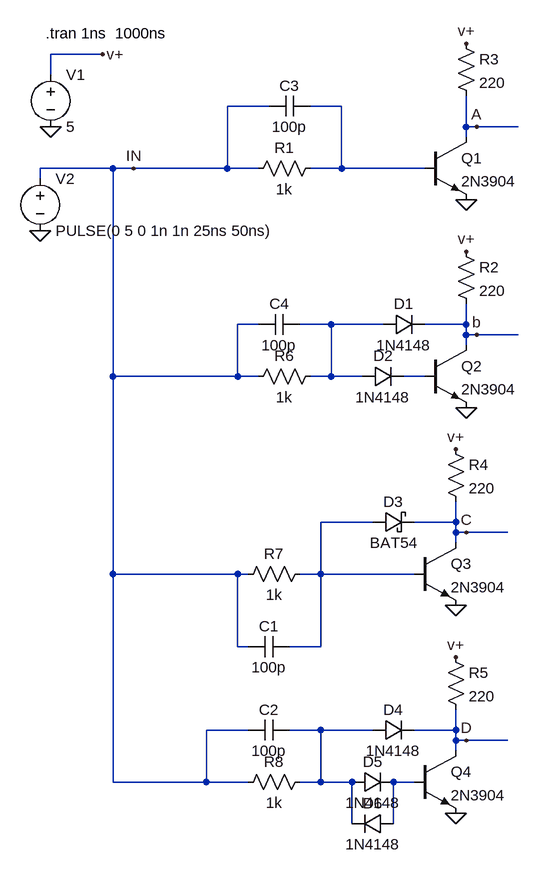
[diagram p0: schematic BakerClamps.asc]
BakerClamps.asc, the LTspice schematic file:
Version 4
SHEET 1 880 952
WIRE -176 -272 -256 -272
WIRE -256 -240 -256 -272
WIRE 80 -192 16 -192
WIRE 192 -192 144 -192
WIRE 384 -160 384 -208
WIRE 400 -160 384 -160
WIRE 464 -160 400 -160
WIRE 384 -144 384 -160
WIRE -160 -96 -272 -96
WIRE -128 -96 -160 -96
WIRE 16 -96 16 -192
WIRE 16 -96 -128 -96
WIRE 64 -96 16 -96
WIRE 192 -96 192 -192
WIRE 192 -96 144 -96
WIRE 320 -96 192 -96
WIRE -272 -80 -272 -96
WIRE 64 144 32 144
WIRE 176 144 128 144
WIRE 256 144 176 144
WIRE 384 144 384 112
WIRE 384 144 320 144
WIRE 384 160 384 144
WIRE 400 160 384 160
WIRE 464 160 400 160
WIRE 384 176 384 160
WIRE -160 224 -160 -96
WIRE 32 224 32 144
WIRE 32 224 -160 224
WIRE 64 224 32 224
WIRE 176 224 176 144
WIRE 176 224 144 224
WIRE 224 224 176 224
WIRE 320 224 288 224
WIRE 240 448 160 448
WIRE 368 448 368 416
WIRE 368 448 304 448
WIRE 368 464 368 448
WIRE 384 464 368 464
WIRE 448 464 384 464
WIRE 368 480 368 464
WIRE -160 528 -160 224
WIRE 32 528 -160 528
WIRE 48 528 32 528
WIRE 160 528 160 448
WIRE 160 528 128 528
WIRE 304 528 160 528
WIRE 32 640 32 528
WIRE 48 640 32 640
WIRE 160 640 160 528
WIRE 160 640 112 640
WIRE 48 768 -16 768
WIRE 160 768 112 768
WIRE 240 768 160 768
WIRE 368 768 368 736
WIRE 368 768 304 768
WIRE 368 784 368 768
WIRE 384 784 368 784
WIRE 448 784 384 784
WIRE 368 800 368 784
WIRE -160 848 -160 528
WIRE -16 848 -16 768
WIRE -16 848 -160 848
WIRE 48 848 -16 848
WIRE 160 848 160 768
WIRE 160 848 128 848
WIRE 208 848 160 848
WIRE 304 848 272 848
WIRE 208 912 208 848
WIRE 272 912 272 848
FLAG -256 -160 0
FLAG -176 -272 v+
FLAG -272 0 0
FLAG -128 -96 IN
FLAG 368 576 0
FLAG 368 336 v+
FLAG 384 464 C
FLAG 368 896 0
FLAG 368 656 v+
FLAG 384 784 D
FLAG 384 -48 0
FLAG 400 -160 A
FLAG 384 -288 v+
FLAG 384 272 0
FLAG 384 32 v+
FLAG 400 160 b
SYMBOL voltage -256 -256 R0
SYMATTR InstName V1
SYMATTR Value 5
SYMBOL voltage -272 -96 R0
SYMATTR InstName V2
SYMATTR Value PULSE(0 5 0 1n 1n 25ns 50ns)
SYMBOL npn 304 480 R0
SYMATTR InstName Q3
SYMATTR Value 2N3904
SYMBOL res 352 320 R0
SYMATTR InstName R4
SYMATTR Value 220
SYMBOL npn 304 800 R0
SYMATTR InstName Q4
SYMATTR Value 2N3904
SYMBOL res 352 640 R0
SYMATTR InstName R5
SYMATTR Value 220
SYMBOL res 144 512 R90
WINDOW 0 0 56 VBottom 2
WINDOW 3 32 56 VTop 2
SYMATTR InstName R7
SYMATTR Value 1k
SYMBOL res 144 832 R90
WINDOW 0 0 56 VBottom 2
WINDOW 3 32 56 VTop 2
SYMATTR InstName R8
SYMATTR Value 1k
SYMBOL schottky 240 464 R270
WINDOW 0 32 32 VTop 2
WINDOW 3 0 32 VBottom 2
SYMATTR InstName D3
SYMATTR Value BAT54
SYMATTR Description Diode
SYMATTR Type diode
SYMBOL diode 240 784 R270
WINDOW 0 32 32 VTop 2
WINDOW 3 0 32 VBottom 2
SYMATTR InstName D4
SYMATTR Value 1N4148
SYMBOL npn 320 -144 R0
SYMATTR InstName Q1
SYMATTR Value 2N3904
SYMBOL res 160 -112 R90
WINDOW 0 0 56 VBottom 2
WINDOW 3 32 56 VTop 2
SYMATTR InstName R1
SYMATTR Value 1k
SYMBOL res 368 -304 R0
SYMATTR InstName R3
SYMATTR Value 220
SYMBOL diode 208 864 R270
WINDOW 0 32 32 VTop 2
WINDOW 3 0 32 VBottom 2
SYMATTR InstName D5
SYMATTR Value 1N4148
SYMBOL diode 272 896 R90
WINDOW 0 0 32 VBottom 2
WINDOW 3 32 32 VTop 2
SYMATTR InstName D6
SYMATTR Value 1N4148
SYMBOL cap 112 624 R90
WINDOW 0 0 32 VBottom 2
WINDOW 3 32 32 VTop 2
SYMATTR InstName C1
SYMATTR Value 100p
SYMBOL cap 112 752 R90
WINDOW 0 0 32 VBottom 2
WINDOW 3 32 32 VTop 2
SYMATTR InstName C2
SYMATTR Value 100p
SYMBOL cap 144 -208 R90
WINDOW 0 0 32 VBottom 2
WINDOW 3 32 32 VTop 2
SYMATTR InstName C3
SYMATTR Value 100p
SYMBOL npn 320 176 R0
SYMATTR InstName Q2
SYMATTR Value 2N3904
SYMBOL res 368 16 R0
SYMATTR InstName R2
SYMATTR Value 220
SYMBOL res 160 208 R90
WINDOW 0 0 56 VBottom 2
WINDOW 3 32 56 VTop 2
SYMATTR InstName R6
SYMATTR Value 1k
SYMBOL diode 256 160 R270
WINDOW 0 32 32 VTop 2
WINDOW 3 0 32 VBottom 2
SYMATTR InstName D1
SYMATTR Value 1N4148
SYMBOL diode 224 240 R270
WINDOW 0 32 32 VTop 2
WINDOW 3 0 32 VBottom 2
SYMATTR InstName D2
SYMATTR Value 1N4148
SYMBOL cap 128 128 R90
WINDOW 0 0 32 VBottom 2
WINDOW 3 32 32 VTop 2
SYMATTR InstName C4
SYMATTR Value 100p
TEXT -264 -304 Left 2 !.tran 1ns  1000ns

The netlist it stands for:
* BakerClamps.asc
V1 v+ 0 5
V2 IN 0 PULSE(0 5 0 1n 1n 25ns 50ns)
Q3 C N004 0 0 2N3904
R4 v+ C 220
Q4 D N006 0 0 2N3904
R5 v+ D 220
R7 N004 IN 1k
R8 N005 IN 1k
D3 N004 C BAT54
D4 N005 D 1N4148
Q1 A N001 0 0 2N3904
R1 N001 IN 1k
R3 v+ A 220
D5 N005 N006 1N4148
D6 N006 N005 1N4148
C1 N004 IN 100p
C2 N005 IN 100p
C3 N001 IN 100p
Q2 b N003 0 0 2N3904
R2 v+ b 220
R6 N002 IN 1k
D1 N002 b 1N4148
D2 N002 N003 1N4148
C4 N002 IN 100p
.model D D
.lib standard.dio
.model NPN NPN
.model PNP PNP
.lib standard.bjt
.tran 1ns  1000ns
.backanno
.end